# Altium schematic sheet main.SchDoc: LD_Harness
size A4; Date: 04.08.2023; DocumentNumber: 1; SheetNumber: 1; SheetTotal: 2; FileInfo: main.SchDoc
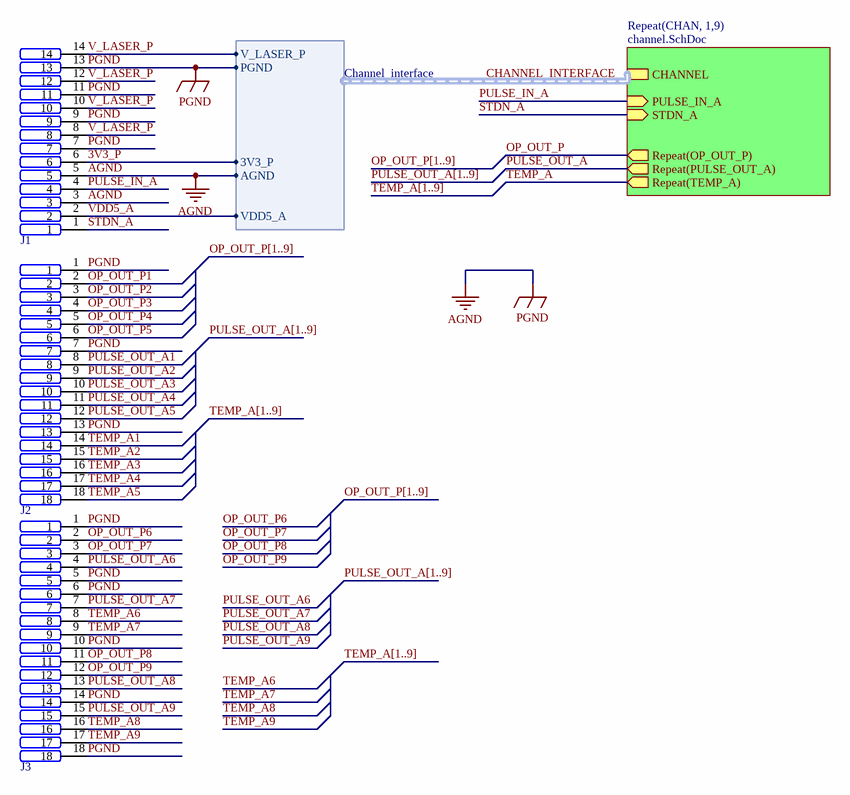
[diagram p0: main.SchDoc]

## Parts
J1  FPC_conn  [FPC_connector_14_1mm]  (value not drawn)  (no BOM)
J2  FPC_conn  [FPC_connector_18_0.5]  (value not drawn)  (no BOM)
J3  FPC_conn  [FPC_connector_18_0.5]  (value not drawn)  (no BOM)

## Sub-sheets
Repeat(CHAN, 1,9) = channel.SchDoc: CHANNEL (harness Channel_interface), Repeat(OP_OUT_P) (out), PULSE_IN_A (in), Repeat(PULSE_OUT_A) (out), STDN_A (in), Repeat(TEMP_A) (out)

## Harnesses
Channel_interface: VDD5_A, AGND, V_LASER_P, PGND, 3V3_P

## Nets
AGND: J1.3 J1.5 J1.7 J1.9 J1.11 J1.13 J2.1 J2.7 J2.13 J3.1 J3.5 J3.6 J3.10 J3.14 J3.18 ; sheet Repeat(CHAN, 1,9)/CHANNEL.AGND  [also labelled PGND]
3V3_P: J1.6 ; sheet Repeat(CHAN, 1,9)/CHANNEL.3V3_P
OP_OUT_P: sheet Repeat(CHAN, 1,9)/Repeat(OP_OUT_P)
OP_OUT_P1: J2.2
OP_OUT_P2: J2.3
OP_OUT_P3: J2.4
OP_OUT_P4: J2.5
OP_OUT_P5: J2.6
OP_OUT_P6: J3.2
OP_OUT_P7: J3.3
OP_OUT_P8: J3.11
OP_OUT_P9: J3.12
PULSE_IN_A: J1.4 ; sheet Repeat(CHAN, 1,9)/PULSE_IN_A
PULSE_OUT_A: sheet Repeat(CHAN, 1,9)/Repeat(PULSE_OUT_A)
PULSE_OUT_A1: J2.8
PULSE_OUT_A2: J2.9
PULSE_OUT_A3: J2.10
PULSE_OUT_A4: J2.11
PULSE_OUT_A5: J2.12
PULSE_OUT_A6: J3.4
PULSE_OUT_A7: J3.7
PULSE_OUT_A8: J3.13
PULSE_OUT_A9: J3.15
STDN_A: J1.1 ; sheet Repeat(CHAN, 1,9)/STDN_A
TEMP_A: sheet Repeat(CHAN, 1,9)/Repeat(TEMP_A)
TEMP_A1: J2.14
TEMP_A2: J2.15
TEMP_A3: J2.16
TEMP_A4: J2.17
TEMP_A5: J2.18
TEMP_A6: J3.8
TEMP_A7: J3.9
TEMP_A8: J3.16
TEMP_A9: J3.17
V_LASER_P: J1.8 J1.10 J1.12 J1.14 ; sheet Repeat(CHAN, 1,9)/CHANNEL.V_LASER_P  [project net CHANNEL_INTERFACE.V_LASER_P]
VDD5_A: J1.2 ; sheet Repeat(CHAN, 1,9)/CHANNEL.VDD5_A  [project net CHANNEL_INTERFACE.VDD5_A]

## Buses and harness runs
bus OP_OUT_P[1..9]
bus PULSE_OUT_A[1..9]
bus TEMP_A[1..9]
harness CHANNEL_INTERFACE = sheet Repeat(CHAN, 1,9)/CHANNEL

## Notes on the sheet
- Project:
- Laboratory:
- Date:
- File:
- Rev:
- Variation:
- Drawn By:
- Checked By:
- Sheet:
- /

## Library data of the parts
J1 = FPC_connector_1mm_14: Connector FPC, 14 pin, 1mm pitch
J2 J3 = FPC_connector: Connector FPC, 18 pin, 0.5mm pitch